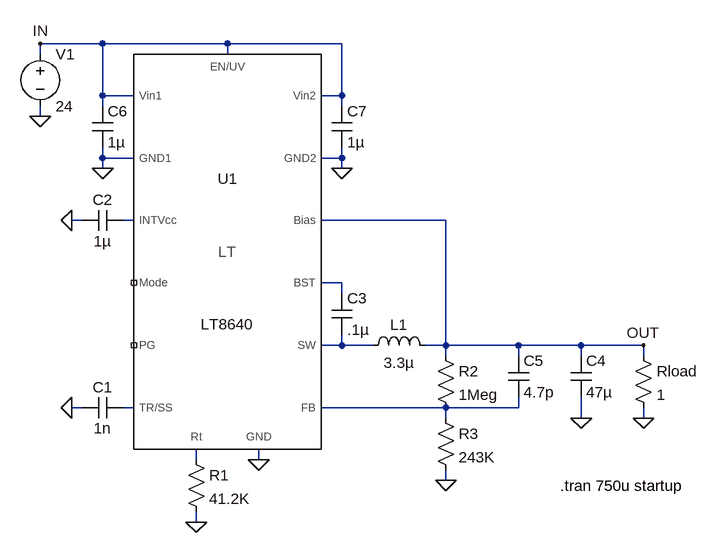
[diagram p0: schematic 8640.asc]
8640.asc, the LTspice schematic file:
Version 4
SHEET 1 1020 680
WIRE 64 -80 -32 -80
WIRE 256 -80 64 -80
WIRE 432 -80 256 -80
WIRE -32 -64 -32 -80
WIRE 256 -64 256 -80
WIRE 64 0 64 -80
WIRE 112 0 64 0
WIRE 432 0 432 -80
WIRE 432 0 400 0
WIRE 64 16 64 0
WIRE 432 16 432 0
WIRE -32 32 -32 16
WIRE 64 96 64 80
WIRE 112 96 64 96
WIRE 432 96 432 80
WIRE 432 96 400 96
WIRE 64 112 64 96
WIRE 432 112 432 96
WIRE 32 192 16 192
WIRE 112 192 96 192
WIRE 592 192 400 192
WIRE 432 288 400 288
WIRE 432 304 432 288
WIRE 432 384 432 368
WIRE 432 384 400 384
WIRE 480 384 432 384
WIRE 592 384 592 192
WIRE 592 384 560 384
WIRE 704 384 592 384
WIRE 800 384 704 384
WIRE 896 384 800 384
WIRE 592 400 592 384
WIRE 704 400 704 384
WIRE 800 400 800 384
WIRE 896 400 896 384
WIRE 32 480 16 480
WIRE 112 480 96 480
WIRE 592 480 400 480
WIRE 704 480 704 464
WIRE 704 480 592 480
WIRE 592 496 592 480
WIRE 800 496 800 464
WIRE 896 496 896 480
WIRE 208 560 208 544
WIRE 304 560 304 544
WIRE 592 592 592 576
WIRE 208 656 208 640
FLAG 304 560 0
FLAG 208 656 0
FLAG -32 32 0
FLAG 16 192 0
FLAG 800 496 0
FLAG 592 592 0
FLAG 896 496 0
FLAG 896 384 OUT
FLAG -32 -80 IN
FLAG 64 112 0
FLAG 432 112 0
FLAG 16 480 0
SYMBOL res 192 544 R0
SYMATTR InstName R1
SYMATTR Value 41.2K
SYMBOL voltage -32 -80 R0
SYMATTR InstName V1
SYMATTR Value 24
SYMBOL cap 96 208 M270
WINDOW 0 32 32 VTop 2
WINDOW 3 0 32 VBottom 2
SYMATTR InstName C2
SYMATTR Value 1µ
SYMBOL ind 464 400 R270
WINDOW 0 32 56 VTop 2
WINDOW 3 5 56 VBottom 2
SYMATTR InstName L1
SYMATTR Value 3.3µ
SYMATTR SpiceLine Rser=10m
SYMBOL cap 416 304 R0
SYMATTR InstName C3
SYMATTR Value .1µ
SYMBOL cap 784 400 R0
SYMATTR InstName C4
SYMATTR Value 47µ
SYMATTR SpiceLine V=6.3 Irms=0 Rser=0.002 Lser=0 mfg="TDK" pn="C4532X5ROJ47@M" type="X5R"
SYMBOL res 576 384 R0
SYMATTR InstName R2
SYMATTR Value 1Meg
SYMBOL res 576 480 R0
SYMATTR InstName R3
SYMATTR Value 243K
SYMBOL cap 688 400 R0
SYMATTR InstName C5
SYMATTR Value 4.7p
SYMBOL res 880 384 R0
SYMATTR InstName Rload
SYMATTR Value 1
SYMBOL cap 48 16 R0
SYMATTR InstName C6
SYMATTR Value 1µ
SYMBOL cap 416 16 R0
SYMATTR InstName C7
SYMATTR Value 1µ
SYMBOL cap 96 496 M270
WINDOW 0 32 32 VTop 2
WINDOW 3 0 32 VBottom 2
SYMATTR InstName C1
SYMATTR Value 1n
SYMBOL PowerProducts\\LT8640 256 240 R0
SYMATTR InstName U1
TEXT 768 600 Left 2 !.tran 750u startup

The netlist it stands for:
* 8640.asc
R1 N006 0 41.2K
V1 IN 0 24
C2 N001 0 1µ
L1 N003 OUT 3.3µ Rser=10m
C3 N002 N003 .1µ
C4 OUT 0 47µ V=6.3 Irms=0 Rser=0.002 Lser=0 mfg="TDK" pn="C4532X5ROJ47@M" type="X5R"
R2 OUT N005 1Meg
R3 N005 0 243K
C5 OUT N005 4.7p
Rload OUT 0 1
C6 IN 0 1µ
C7 IN 0 1µ
C1 N004 0 1n
XU1 OUT N001 N002 IN 0 N003 0 IN IN N006 N004 NC_01 0 NC_02 N005 LT8640  ; pins Bias INTVcc BST Vin1 GND1 SW GND2 Vin2 EN/UV Rt TR/SS Mode GND PG FB
.tran 750u startup
.lib LT8640.sub
.backanno
.end